# Altium project PROC101D_SCH_With_Design_Updates..Notes_V1.0.PrjPcb (part 12 of 23)

## Sheet 27.SchDoc
size 513 x 386 mm
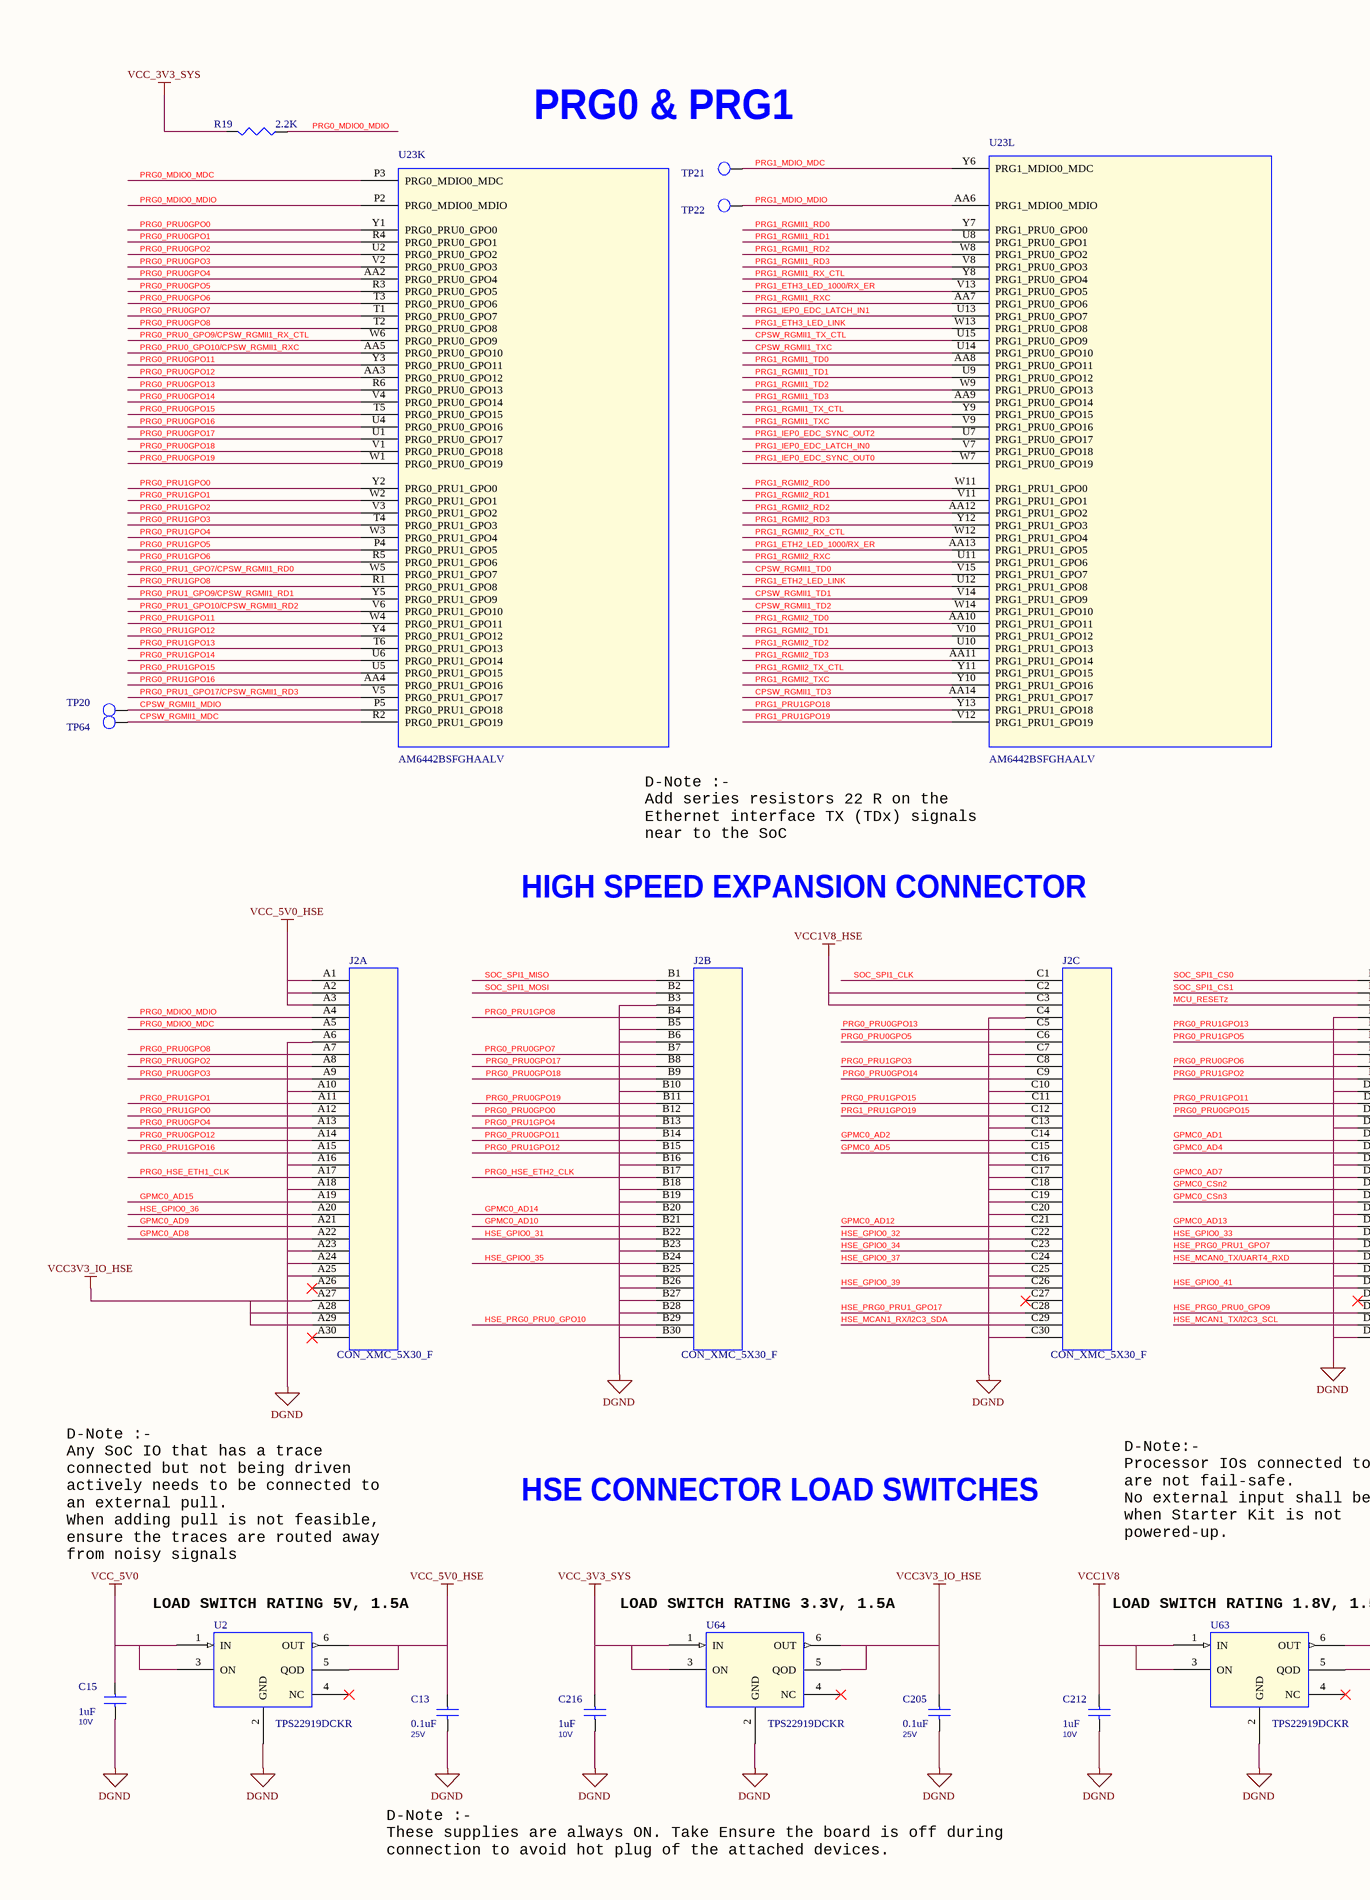
[diagram p46: 27.SchDoc, left]
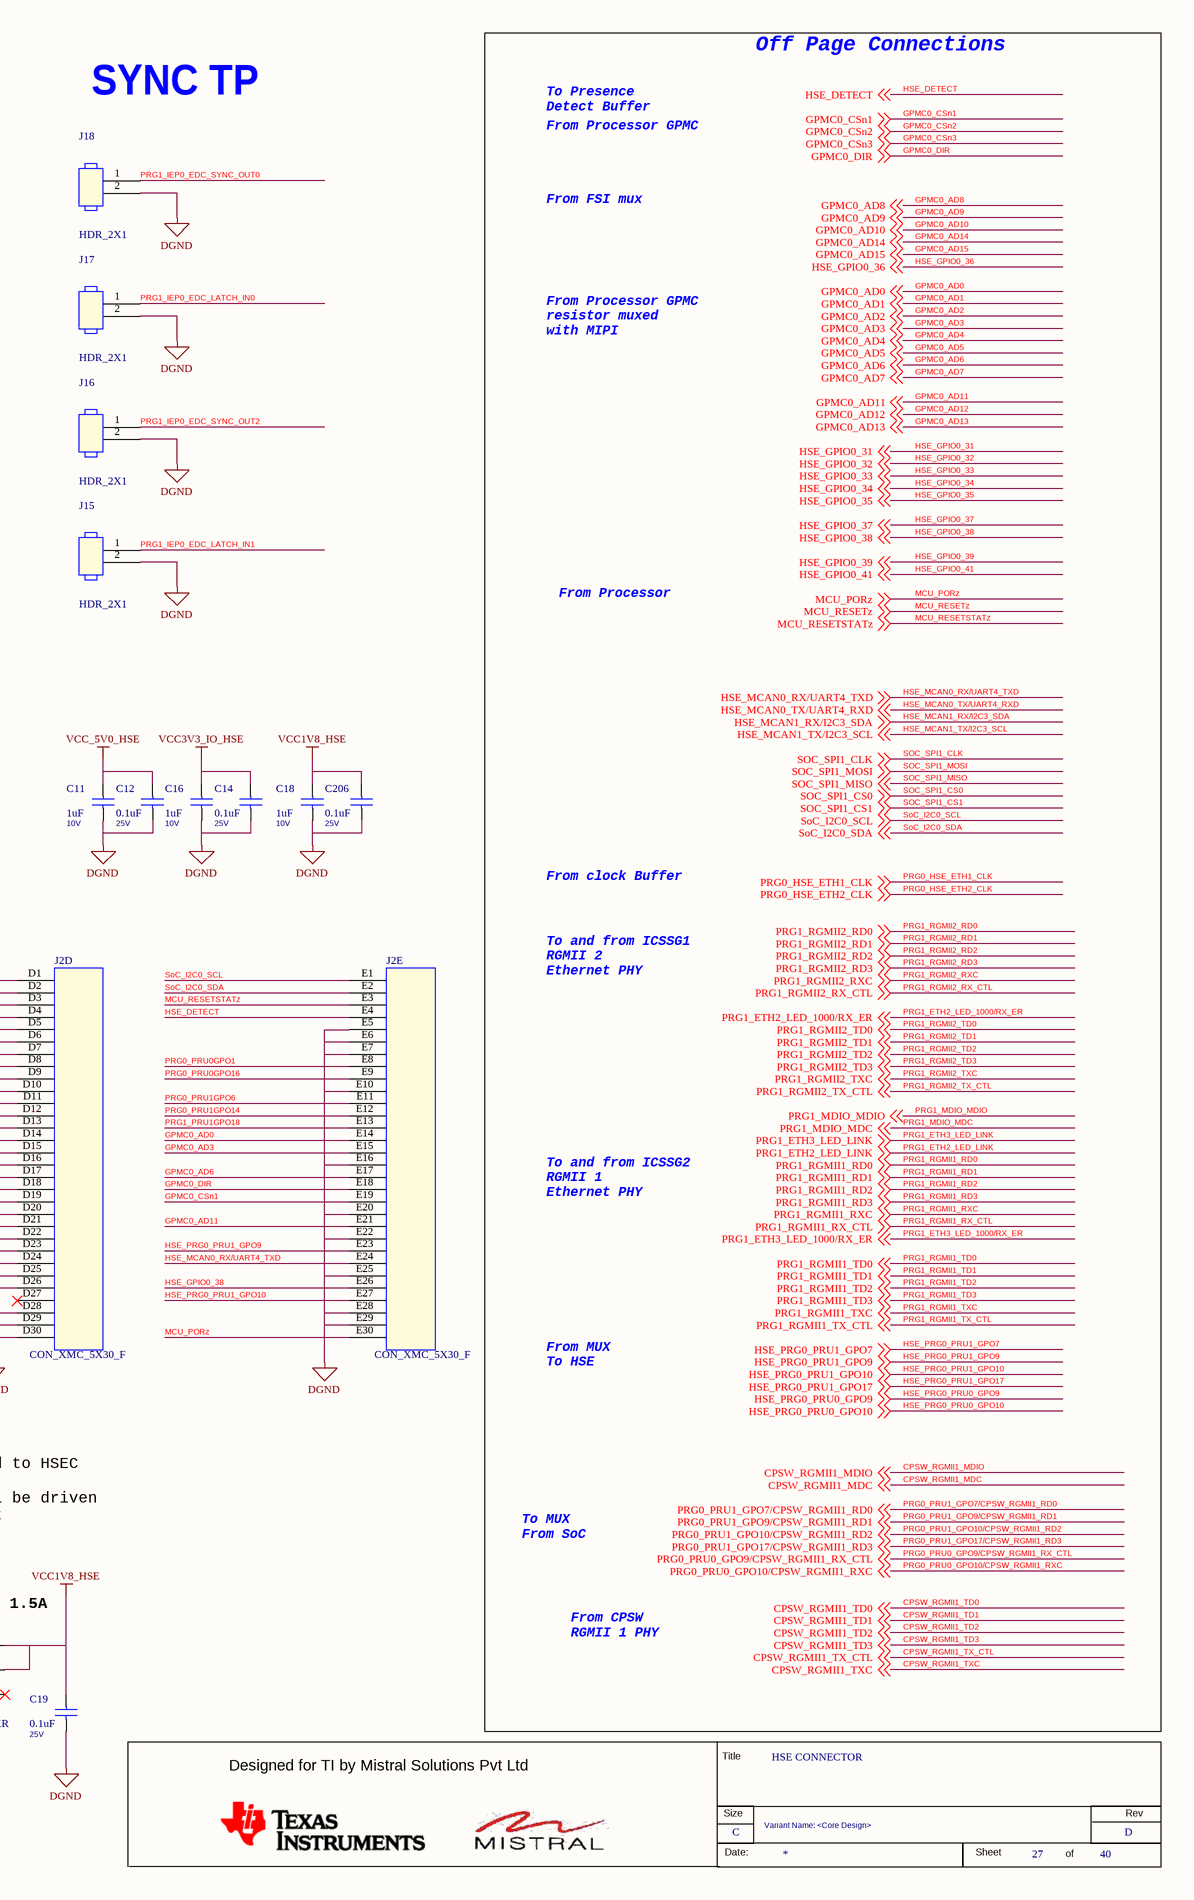
[diagram p47: 27.SchDoc, right]

### Parts
(Parts that share a designator on the sheet are numbered #1, #2 ... from top to bottom, then left to right.)
*#27  RevCode: D  Title: HSE CONNECTOR  Page Size: C  Page Number: 27  Page Count: 40  Variant Name: <Core Design>  (hidden comment: MISTRAL_TITLEBLK_CSIZE)  (graphical)
C11  1uF  Voltage: 10V  [CAP0402_0-75]
C12  0.1uF  Voltage: 25V  [CAP0402_0-75]
C13  0.1uF  Voltage: 25V  [CAP0402_0-75]
C14  0.1uF  Voltage: 25V  [CAP0402_0-75]
C15  1uF  Voltage: 10V  [CAP0402_0-75]
C16  1uF  Voltage: 10V  [CAP0402_0-75]
C18  1uF  Voltage: 10V  [CAP0402_0-75]
C19  0.1uF  Voltage: 25V  [CAP0402_0-75]
C205  0.1uF  Voltage: 25V  [CAP0402_0-75]
C206  0.1uF  Voltage: 25V  [CAP0402_0-75]
C212  1uF  Voltage: 10V  [CAP0402_0-75]
C216  1uF  Voltage: 10V  [CAP0402_0-75]
J2  CON_XMC_5X30_F  [CON_XMC5X30_SEAF-30-06-05-2-A_S_S_S_6-4]  (parts A,B,C,D,E of 5)
J15  HDR_2X1  [HDR_2X1_100_S_T]
J16  HDR_2X1  [HDR_2X1_100_S_T]
J17  HDR_2X1  [HDR_2X1_100_S_T]
J18  HDR_2X1  [HDR_2X1_100_S_T]
R19  2.2K  [RES0402_0-5]
TP20  TP20_SMD  [TP20_SMD]  (value not drawn)
TP21  TP20_SMD  [TP20_SMD]  (value not drawn)
TP22  TP20_SMD  [TP20_SMD]  (value not drawn)
TP64  TP20_SMD  [TP20_SMD]  (value not drawn)
U2  TPS22919DCKR  [SC70-6_1-1]
U23  AM6442BSFGHAALV  [FCBGA441_31-49_680X680_2-6]  (parts K,L of 16)
U63  TPS22919DCKR  [SC70-6_1-1]
U64  TPS22919DCKR  [SC70-6_1-1]

### Nets
DGND: C11.2 C12.2 C13.2 C14.2 C15.2 C16.2 C18.2 C19.2 C205.2 C206.2 C212.2 C216.2 J2.A6 J2.A10 J2.A16 J2.A18 J2.A23 J2.A24 J2.A25 J2.B3 J2.B5 J2.B6 J2.B10 J2.B16 J2.B18 J2.B19 J2.B23 J2.B25 J2.B26 J2.B27 J2.B28 J2.B30 J2.C4 J2.C7 J2.C10 J2.C13 J2.C16 J2.C17 J2.C18 J2.C19 J2.C20 J2.C25 J2.C30 J2.D4 J2.D7 J2.D10 J2.D13 J2.D16 J2.D20 J2.D25 J2.D30 J2.E5 J2.E6 J2.E7 J2.E10 J2.E16 J2.E20 J2.E22 J2.E25 J2.E28 J2.E29 J15.2 J16.2 J17.2 J18.2 U2.2(GND) U63.2(GND) U64.2(GND)
VCC1V8: C212.1 U63.1(IN) U63.3(ON)
VCC1V8_HSE: C18.1 C19.1 C206.1 J2.C2 J2.C3 U63.5(QOD) U63.6(OUT)
VCC3V3_IO_HSE: C14.1 C16.1 C205.1 J2.A27 J2.A28 J2.A29 U64.5(QOD) U64.6(OUT)
VCC_3V3_SYS: C216.1 R19.2 U64.1(IN) U64.3(ON)
VCC_5V0: C15.1 U2.1(IN) U2.3(ON)
VCC_5V0_HSE: C11.1 C12.1 C13.1 J2.A1 J2.A2 J2.A3 U2.5(QOD) U2.6(OUT)
CPSW_RGMII1_MDC: TP64.1(TP) U23.R2(PRG0_PRU1_GPO19) ; off-sheet CPSW_RGMII1_MDC
CPSW_RGMII1_MDIO: TP20.1(TP) U23.P5(PRG0_PRU1_GPO18) ; off-sheet CPSW_RGMII1_MDIO
CPSW_RGMII1_TD0: U23.V15(PRG1_PRU1_GPO7) ; off-sheet CPSW_RGMII1_TD0
CPSW_RGMII1_TD1: U23.V14(PRG1_PRU1_GPO9) ; off-sheet CPSW_RGMII1_TD1
CPSW_RGMII1_TD2: U23.W14(PRG1_PRU1_GPO10) ; off-sheet CPSW_RGMII1_TD2
CPSW_RGMII1_TD3: U23.AA14(PRG1_PRU1_GPO17) ; off-sheet CPSW_RGMII1_TD3
CPSW_RGMII1_TX_CTL: U23.U15(PRG1_PRU0_GPO9) ; off-sheet CPSW_RGMII1_TX_CTL
CPSW_RGMII1_TXC: U23.U14(PRG1_PRU0_GPO10) ; off-sheet CPSW_RGMII1_TXC
GPMC0_AD0: J2.E14 ; off-sheet GPMC0_AD0
GPMC0_AD1: J2.D14 ; off-sheet GPMC0_AD1
GPMC0_AD2: J2.C14 ; off-sheet GPMC0_AD2
GPMC0_AD3: J2.E15 ; off-sheet GPMC0_AD3
GPMC0_AD4: J2.D15 ; off-sheet GPMC0_AD4
GPMC0_AD5: J2.C15 ; off-sheet GPMC0_AD5
GPMC0_AD6: J2.E17 ; off-sheet GPMC0_AD6
GPMC0_AD7: J2.D17 ; off-sheet GPMC0_AD7
GPMC0_AD8: J2.A22 ; off-sheet GPMC0_AD8
GPMC0_AD9: J2.A21 ; off-sheet GPMC0_AD9
GPMC0_AD10: J2.B21 ; off-sheet GPMC0_AD10
GPMC0_AD11: J2.E21 ; off-sheet GPMC0_AD11
GPMC0_AD12: J2.C21 ; off-sheet GPMC0_AD12
GPMC0_AD13: J2.D21 ; off-sheet GPMC0_AD13
GPMC0_AD14: J2.B20 ; off-sheet GPMC0_AD14
GPMC0_AD15: J2.A19 ; off-sheet GPMC0_AD15
GPMC0_CSn1: J2.E19 ; off-sheet GPMC0_CSn1
GPMC0_CSn2: J2.D18 ; off-sheet GPMC0_CSn2
GPMC0_CSn3: J2.D19 ; off-sheet GPMC0_CSn3
GPMC0_DIR: J2.E18 ; off-sheet GPMC0_DIR
HSE_DETECT: J2.E4 ; off-sheet HSE_DETECT
HSE_GPIO0_31: J2.B22 ; off-sheet HSE_GPIO0_31
HSE_GPIO0_32: J2.C22 ; off-sheet HSE_GPIO0_32
HSE_GPIO0_33: J2.D22 ; off-sheet HSE_GPIO0_33
HSE_GPIO0_34: J2.C23 ; off-sheet HSE_GPIO0_34
HSE_GPIO0_35: J2.B24 ; off-sheet HSE_GPIO0_35
HSE_GPIO0_36: J2.A20 ; off-sheet HSE_GPIO0_36
HSE_GPIO0_37: J2.C24 ; off-sheet HSE_GPIO0_37
HSE_GPIO0_38: J2.E26 ; off-sheet HSE_GPIO0_38
HSE_GPIO0_39: J2.C26 ; off-sheet HSE_GPIO0_39
HSE_GPIO0_41: J2.D26 ; off-sheet HSE_GPIO0_41
HSE_MCAN0_RX/UART4_TXD: J2.E24 ; off-sheet HSE_MCAN0_RX/UART4_TXD
HSE_MCAN0_TX/UART4_RXD: J2.D24 ; off-sheet HSE_MCAN0_TX/UART4_RXD
HSE_MCAN1_RX/I2C3_SDA: J2.C29 ; off-sheet HSE_MCAN1_RX/I2C3_SDA
HSE_MCAN1_TX/I2C3_SCL: J2.D29 ; off-sheet HSE_MCAN1_TX/I2C3_SCL
HSE_PRG0_PRU0_GPO9: J2.D28 ; off-sheet HSE_PRG0_PRU0_GPO9
HSE_PRG0_PRU0_GPO10: J2.B29 ; off-sheet HSE_PRG0_PRU0_GPO10
HSE_PRG0_PRU1_GPO7: J2.D23 ; off-sheet HSE_PRG0_PRU1_GPO7
HSE_PRG0_PRU1_GPO9: J2.E23 ; off-sheet HSE_PRG0_PRU1_GPO9
HSE_PRG0_PRU1_GPO10: J2.E27 ; off-sheet HSE_PRG0_PRU1_GPO10
HSE_PRG0_PRU1_GPO17: J2.C28 ; off-sheet HSE_PRG0_PRU1_GPO17
MCU_PORz: J2.E30 ; off-sheet MCU_PORz
MCU_RESETSTATz: J2.E3 ; off-sheet MCU_RESETSTATz
MCU_RESETz: J2.D3 ; off-sheet MCU_RESETz
PRG0_HSE_ETH1_CLK: J2.A17 ; off-sheet PRG0_HSE_ETH1_CLK
PRG0_HSE_ETH2_CLK: J2.B17 ; off-sheet PRG0_HSE_ETH2_CLK
PRG0_MDIO0_MDC: J2.A5 U23.P3(PRG0_MDIO0_MDC)
PRG0_MDIO0_MDIO: J2.A4 R19.1 U23.P2(PRG0_MDIO0_MDIO)
PRG0_PRU0_GPO9/CPSW_RGMII1_RX_CTL: U23.W6(PRG0_PRU0_GPO9) ; off-sheet PRG0_PRU0_GPO9/CPSW_RGMII1_RX_CTL
PRG0_PRU0_GPO10/CPSW_RGMII1_RXC: U23.AA5(PRG0_PRU0_GPO10) ; off-sheet PRG0_PRU0_GPO10/CPSW_RGMII1_RXC
PRG0_PRU0GPO0: J2.B12 U23.Y1(PRG0_PRU0_GPO0)
PRG0_PRU0GPO1: J2.E8 U23.R4(PRG0_PRU0_GPO1)
PRG0_PRU0GPO2: J2.A8 U23.U2(PRG0_PRU0_GPO2)
PRG0_PRU0GPO3: J2.A9 U23.V2(PRG0_PRU0_GPO3)
PRG0_PRU0GPO4: J2.A13 U23.AA2(PRG0_PRU0_GPO4)
PRG0_PRU0GPO5: J2.C6 U23.R3(PRG0_PRU0_GPO5)
PRG0_PRU0GPO6: J2.D8 U23.T3(PRG0_PRU0_GPO6)
PRG0_PRU0GPO7: J2.B7 U23.T1(PRG0_PRU0_GPO7)
PRG0_PRU0GPO8: J2.A7 U23.T2(PRG0_PRU0_GPO8)
PRG0_PRU0GPO11: J2.B14 U23.Y3(PRG0_PRU0_GPO11)
PRG0_PRU0GPO12: J2.A14 U23.AA3(PRG0_PRU0_GPO12)
PRG0_PRU0GPO13: J2.C5 U23.R6(PRG0_PRU0_GPO13)
PRG0_PRU0GPO14: J2.C9 U23.V4(PRG0_PRU0_GPO14)
PRG0_PRU0GPO15: J2.D12 U23.T5(PRG0_PRU0_GPO15)
PRG0_PRU0GPO16: J2.E9 U23.U4(PRG0_PRU0_GPO16)
PRG0_PRU0GPO17: J2.B8 U23.U1(PRG0_PRU0_GPO17)
PRG0_PRU0GPO18: J2.B9 U23.V1(PRG0_PRU0_GPO18)
PRG0_PRU0GPO19: J2.B11 U23.W1(PRG0_PRU0_GPO19)
PRG0_PRU1_GPO7/CPSW_RGMII1_RD0: U23.W5(PRG0_PRU1_GPO7) ; off-sheet PRG0_PRU1_GPO7/CPSW_RGMII1_RD0
PRG0_PRU1_GPO9/CPSW_RGMII1_RD1: U23.Y5(PRG0_PRU1_GPO9) ; off-sheet PRG0_PRU1_GPO9/CPSW_RGMII1_RD1
PRG0_PRU1_GPO10/CPSW_RGMII1_RD2: U23.V6(PRG0_PRU1_GPO10) ; off-sheet PRG0_PRU1_GPO10/CPSW_RGMII1_RD2
PRG0_PRU1_GPO17/CPSW_RGMII1_RD3: U23.V5(PRG0_PRU1_GPO17) ; off-sheet PRG0_PRU1_GPO17/CPSW_RGMII1_RD3
PRG0_PRU1GPO0: J2.A12 U23.Y2(PRG0_PRU1_GPO0)
PRG0_PRU1GPO1: J2.A11 U23.W2(PRG0_PRU1_GPO1)
PRG0_PRU1GPO2: J2.D9 U23.V3(PRG0_PRU1_GPO2)
PRG0_PRU1GPO3: J2.C8 U23.T4(PRG0_PRU1_GPO3)
PRG0_PRU1GPO4: J2.B13 U23.W3(PRG0_PRU1_GPO4)
PRG0_PRU1GPO5: J2.D6 U23.P4(PRG0_PRU1_GPO5)
PRG0_PRU1GPO6: J2.E11 U23.R5(PRG0_PRU1_GPO6)
PRG0_PRU1GPO8: J2.B4 U23.R1(PRG0_PRU1_GPO8)
PRG0_PRU1GPO11: J2.D11 U23.W4(PRG0_PRU1_GPO11)
PRG0_PRU1GPO12: J2.B15 U23.Y4(PRG0_PRU1_GPO12)
PRG0_PRU1GPO13: J2.D5 U23.T6(PRG0_PRU1_GPO13)
PRG0_PRU1GPO14: J2.E12 U23.U6(PRG0_PRU1_GPO14)
PRG0_PRU1GPO15: J2.C11 U23.U5(PRG0_PRU1_GPO15)
PRG0_PRU1GPO16: J2.A15 U23.AA4(PRG0_PRU1_GPO16)
PRG1_ETH2_LED_1000/RX_ER: U23.AA13(PRG1_PRU1_GPO5) ; off-sheet PRG1_ETH2_LED_1000/RX_ER
PRG1_ETH2_LED_LINK: U23.U12(PRG1_PRU1_GPO8) ; off-sheet PRG1_ETH2_LED_LINK
PRG1_ETH3_LED_1000/RX_ER: U23.V13(PRG1_PRU0_GPO5) ; off-sheet PRG1_ETH3_LED_1000/RX_ER
PRG1_ETH3_LED_LINK: U23.W13(PRG1_PRU0_GPO8) ; off-sheet PRG1_ETH3_LED_LINK
PRG1_IEP0_EDC_LATCH_IN0: J17.1 U23.V7(PRG1_PRU0_GPO18)
PRG1_IEP0_EDC_LATCH_IN1: J15.1 U23.U13(PRG1_PRU0_GPO7)
PRG1_IEP0_EDC_SYNC_OUT0: J18.1 U23.W7(PRG1_PRU0_GPO19)
PRG1_IEP0_EDC_SYNC_OUT2: J16.1 U23.U7(PRG1_PRU0_GPO17)
PRG1_MDIO_MDC: TP21.1(TP) U23.Y6(PRG1_MDIO0_MDC) ; off-sheet PRG1_MDIO_MDC
PRG1_MDIO_MDIO: TP22.1(TP) U23.AA6(PRG1_MDIO0_MDIO) ; off-sheet PRG1_MDIO_MDIO
PRG1_PRU1GPO18: J2.E13 U23.Y13(PRG1_PRU1_GPO18)
PRG1_PRU1GPO19: J2.C12 U23.V12(PRG1_PRU1_GPO19)
PRG1_RGMII1_RD0: U23.Y7(PRG1_PRU0_GPO0) ; off-sheet PRG1_RGMII1_RD0
PRG1_RGMII1_RD1: U23.U8(PRG1_PRU0_GPO1) ; off-sheet PRG1_RGMII1_RD1
PRG1_RGMII1_RD2: U23.W8(PRG1_PRU0_GPO2) ; off-sheet PRG1_RGMII1_RD2
PRG1_RGMII1_RD3: U23.V8(PRG1_PRU0_GPO3) ; off-sheet PRG1_RGMII1_RD3
PRG1_RGMII1_RX_CTL: U23.Y8(PRG1_PRU0_GPO4) ; off-sheet PRG1_RGMII1_RX_CTL
PRG1_RGMII1_RXC: U23.AA7(PRG1_PRU0_GPO6) ; off-sheet PRG1_RGMII1_RXC
PRG1_RGMII1_TD0: U23.AA8(PRG1_PRU0_GPO11) ; off-sheet PRG1_RGMII1_TD0
PRG1_RGMII1_TD1: U23.U9(PRG1_PRU0_GPO12) ; off-sheet PRG1_RGMII1_TD1
PRG1_RGMII1_TD2: U23.W9(PRG1_PRU0_GPO13) ; off-sheet PRG1_RGMII1_TD2
PRG1_RGMII1_TD3: U23.AA9(PRG1_PRU0_GPO14) ; off-sheet PRG1_RGMII1_TD3
PRG1_RGMII1_TX_CTL: U23.Y9(PRG1_PRU0_GPO15) ; off-sheet PRG1_RGMII1_TX_CTL
PRG1_RGMII1_TXC: U23.V9(PRG1_PRU0_GPO16) ; off-sheet PRG1_RGMII1_TXC
PRG1_RGMII2_RD0: U23.W11(PRG1_PRU1_GPO0) ; off-sheet PRG1_RGMII2_RD0
PRG1_RGMII2_RD1: U23.V11(PRG1_PRU1_GPO1) ; off-sheet PRG1_RGMII2_RD1
PRG1_RGMII2_RD2: U23.AA12(PRG1_PRU1_GPO2) ; off-sheet PRG1_RGMII2_RD2
PRG1_RGMII2_RD3: U23.Y12(PRG1_PRU1_GPO3) ; off-sheet PRG1_RGMII2_RD3
PRG1_RGMII2_RX_CTL: U23.W12(PRG1_PRU1_GPO4) ; off-sheet PRG1_RGMII2_RX_CTL
PRG1_RGMII2_RXC: U23.U11(PRG1_PRU1_GPO6) ; off-sheet PRG1_RGMII2_RXC
PRG1_RGMII2_TD0: U23.AA10(PRG1_PRU1_GPO11) ; off-sheet PRG1_RGMII2_TD0
PRG1_RGMII2_TD1: U23.V10(PRG1_PRU1_GPO12) ; off-sheet PRG1_RGMII2_TD1
PRG1_RGMII2_TD2: U23.U10(PRG1_PRU1_GPO13) ; off-sheet PRG1_RGMII2_TD2
PRG1_RGMII2_TD3: U23.AA11(PRG1_PRU1_GPO14) ; off-sheet PRG1_RGMII2_TD3
PRG1_RGMII2_TX_CTL: U23.Y11(PRG1_PRU1_GPO15) ; off-sheet PRG1_RGMII2_TX_CTL
PRG1_RGMII2_TXC: U23.Y10(PRG1_PRU1_GPO16) ; off-sheet PRG1_RGMII2_TXC
SoC_I2C0_SCL: J2.E1 ; off-sheet SoC_I2C0_SCL
SoC_I2C0_SDA: J2.E2 ; off-sheet SoC_I2C0_SDA
SOC_SPI1_CLK: J2.C1 ; off-sheet SOC_SPI1_CLK
SOC_SPI1_CS0: J2.D1 ; off-sheet SOC_SPI1_CS0
SOC_SPI1_CS1: J2.D2 ; off-sheet SOC_SPI1_CS1
SOC_SPI1_MISO: J2.B1 ; off-sheet SOC_SPI1_MISO
SOC_SPI1_MOSI: J2.B2 ; off-sheet SOC_SPI1_MOSI

Not connected (* = marked no-connect by the designer): J2 A26* A30* C27* D27*; U2 4(NC)*; U63 4(NC)*; U64 4(NC)*

### Notes on the sheet
- Off Page Connections
- SYNC TP
- To Presence
  Detect Buffer
- (near TP21) PRG0 & PRG1
- From Processor GPMC
- From FSI mux
- From Processor GPMC
  resistor muxed
  with MIPI
- From Processor
- D-Note :-
  Add series resistors 22 R on the
  Ethernet interface TX (TDx) signals
  near to the SoC
- HIGH SPEED EXPANSION CONNECTOR
- From clock Buffer
- To and from ICSSG1
  RGMII 2
  Ethernet PHY
- To and from ICSSG2
  RGMII 1
  Ethernet PHY
- From MUX
  To HSE
- D-Note :-
  Any SoC IO that has a trace
  connected but not being driven
  actively needs to be connected to
  an external pull.
  When adding pull is not feasible,
  ensure the traces are routed away
  from noisy signals
- D-Note:-
  Processor IOs connected to HSEC
  are not fail-safe.
  No external input shall be driven
  when Starter Kit is not
  powered-up.
- HSE CONNECTOR LOAD SWITCHES
- To MUX
  From SoC
- (near U2) LOAD SWITCH RATING 5V, 1.5A
- (near U64) LOAD SWITCH RATING 3.3V, 1.5A
- (near U63) LOAD SWITCH RATING 1.8V, 1.5A
- From CPSW
  RGMII 1 PHY
- D-Note :-
  These supplies are always ON. Take Ensure the board is off during
  connection to avoid hot plug of the attached devices.
- (in symbol MISTRAL_TITLEBLK_CSIZE) Title; Designed for TI by Mistral Solutions Pvt Ltd; Size; Rev; Date:; Sheet; of

### Library data of the parts
*#27 = MISTRAL_TITLEBLK_CSIZE: Issue: 1.0; Page Create Date: March  8, 1995; Page Modify Date: *
C11 C18 = CAP_Dup3: CAP CERAMIC 1uF 10V 20% X5R 0402; Mistral Part No: 120020080009-R; Mfr_name: WURTH ELECTRONICS; Mfr_part_number: 885012105012; Part_type: CAPACITORS\CERAMIC; Wattage: NA; Project: AM64x_EVM_BRD; Customs_HS_Code: 85322990; Custom_Duty: 15%; Footprint Ref: CAP0402_0-75; Library Ref: CAP; Footprint Path: Y:\MIS_DATABASE\Library\ALTIUM_TOOL\PCB_FOOTPRINTS\Altium_Footprint_Lib.PcbLib; Library Path: Y:\MIS_DATABASE\Library\ALTIUM_TOOL\SCHEMATICS_PARTS\MS_DISCRETE_Library.schlib; MECHANICAL 3D STEP FILE: CAP0402_0-75; Tolerance: 20%; Package: 0402; Distributor_name: DIGIKEY; Distributor_part_number: 732-7489-1-ND; Height: 0.55MM; Weight: 0.65mg; Temperature: -55癈+85癈; Datasheet: Y:\MIS_DATABASE\DATASHEETS\CAPACITORS\885012105012.PDF; Crtd /date: ALVY/190820; Chkd/date: MANIRAJA/210820; PCB Footprint: CAP0402_0-75
C12-C14 C206 = CAP_Dup3: CAP CERAMIC 0.1uF 25V 20% X5R 0402; Alt_Mfr_name: YAGEO AMERICA; Part_type: CAPACITORS\CERAMIC; Mfr_part_number: 885012105018; Mfr_name: WURTH ELECTRONICS; Mistral Part No: 120020080003-R; Alt_Mfr_part_number: CC0402KRX5R8BB104; Custom_Duty: 15%; Customs_HS_Code: 85322990; Wattage: NA; Project: AM64x_EVM_BRD; Footprint Path: Y:\MIS_DATABASE\Library\ALTIUM_TOOL\PCB_FOOTPRINTS\Altium_Footprint_Lib.PcbLib; Library Path: Y:\MIS_DATABASE\Library\ALTIUM_TOOL\SCHEMATICS_PARTS\MS_DISCRETE_Library.schlib; Footprint Ref: CAP0402_0-75; Library Ref: CAP; MECHANICAL 3D STEP FILE: CAP0402_0-75; Chkd/date: MANIRAJA/170820; Crtd /date: ALVY/170820; Datasheet: Y:\MIS_DATABASE\DATASHEETS\CAPACITORS\885012105018.PDF; Temperature: -55癈+85癈; Weight: 0.65mg; Height: 0.55MM; Distributor_part_number: 732-7495-1-ND; Distributor_name: DIGIKEY; Package: 0402; Tolerance: 20%; PCB Footprint: CAP0402_0-75
C15 C216 = CAP_Dup3: CAP CERAMIC 1uF 10V 20% X5R 0402; Mistral Part No: 120020080009-R; Mfr_name: WURTH ELECTRONICS; Mfr_part_number: 885012105012; Part_type: CAPACITORS\CERAMIC; Project: AM64x_EVM_BRD; Wattage: NA; Customs_HS_Code: 85322990; Custom_Duty: 15%; PCB Footprint: CAP0402_0-75; Footprint Path: Y:\MIS_DATABASE\Library\ALTIUM_TOOL\PCB_FOOTPRINTS\Altium_Footprint_Lib.PcbLib; Library Path: Y:\MIS_DATABASE\Library\ALTIUM_TOOL\SCHEMATICS_PARTS\MS_DISCRETE_Library.schlib; Footprint Ref: CAP0402_0-75; Library Ref: CAP; MECHANICAL 3D STEP FILE: CAP0402_0-75; Tolerance: 20%; Package: 0402; Distributor_name: DIGIKEY; Distributor_part_number: 732-7489-1-ND; Height: 0.55MM; Weight: 0.65mg; Temperature: -55癈+85癈; Datasheet: Y:\MIS_DATABASE\DATASHEETS\CAPACITORS\885012105012.PDF; Crtd /date: ALVY/190820; Chkd/date: MANIRAJA/210820
C16 = CAP_Dup3: CAP CERAMIC 1uF 10V 20% X5R 0402; Part_type: CAPACITORS\CERAMIC; Mfr_part_number: 885012105012; Mfr_name: WURTH ELECTRONICS; Mistral Part No: 120020080009-R; Wattage: NA; Custom_Duty: 15%; Customs_HS_Code: 85322990; Project: AM64x_EVM_BRD; Footprint Ref: CAP0402_0-75; Library Ref: CAP; Footprint Path: Y:\MIS_DATABASE\Library\ALTIUM_TOOL\PCB_FOOTPRINTS\Altium_Footprint_Lib.PcbLib; Library Path: Y:\MIS_DATABASE\Library\ALTIUM_TOOL\SCHEMATICS_PARTS\MS_DISCRETE_Library.schlib; MECHANICAL 3D STEP FILE: CAP0402_0-75; Chkd/date: MANIRAJA/210820; Crtd /date: ALVY/190820; Datasheet: Y:\MIS_DATABASE\DATASHEETS\CAPACITORS\885012105012.PDF; Temperature: -55癈+85癈; Weight: 0.65mg; Height: 0.55MM; Distributor_part_number: 732-7489-1-ND; Distributor_name: DIGIKEY; Package: 0402; Tolerance: 20%; PCB Footprint: CAP0402_0-75
C19 C205 = CAP_Dup3: CAP CERAMIC 0.1uF 25V 20% X5R 0402; Alt_Mfr_part_number: CC0402KRX5R8BB104; Mistral Part No: 120020080003-R; Mfr_name: WURTH ELECTRONICS; Mfr_part_number: 885012105018; Part_type: CAPACITORS\CERAMIC; Alt_Mfr_name: YAGEO AMERICA; Project: AM64x_EVM_BRD; Wattage: NA; Customs_HS_Code: 85322990; Custom_Duty: 15%; PCB Footprint: CAP0402_0-75; Tolerance: 20%; Package: 0402; Distributor_name: DIGIKEY; Distributor_part_number: 732-7495-1-ND; Height: 0.55MM; Weight: 0.65mg; Temperature: -55癈+85癈; Datasheet: Y:\MIS_DATABASE\DATASHEETS\CAPACITORS\885012105018.PDF; Crtd /date: ALVY/170820; Chkd/date: MANIRAJA/170820; MECHANICAL 3D STEP FILE: CAP0402_0-75; Library Ref: CAP; Footprint Ref: CAP0402_0-75; Library Path: Y:\MIS_DATABASE\Library\ALTIUM_TOOL\SCHEMATICS_PARTS\MS_DISCRETE_Library.schlib; Footprint Path: Y:\MIS_DATABASE\Library\ALTIUM_TOOL\PCB_FOOTPRINTS\Altium_Footprint_Lib.PcbLib
C212 = CAP_Dup3: CAP CERAMIC 1uF 10V 20% X5R 0402; Part_type: CAPACITORS\CERAMIC; Mfr_part_number: 885012105012; Mfr_name: WURTH ELECTRONICS; Mistral Part No: 120020080009-R; Custom_Duty: 15%; Customs_HS_Code: 85322990; Wattage: NA; Project: AM64x_EVM_BRD; PCB Footprint: CAP0402_0-75; Chkd/date: MANIRAJA/210820; Crtd /date: ALVY/190820; Datasheet: Y:\MIS_DATABASE\DATASHEETS\CAPACITORS\885012105012.PDF; Temperature: -55癈+85癈; Weight: 0.65mg; Height: 0.55MM; Distributor_part_number: 732-7489-1-ND; Distributor_name: DIGIKEY; Package: 0402; Tolerance: 20%; MECHANICAL 3D STEP FILE: CAP0402_0-75; Library Ref: CAP; Footprint Ref: CAP0402_0-75; Library Path: Y:\MIS_DATABASE\Library\ALTIUM_TOOL\SCHEMATICS_PARTS\MS_DISCRETE_Library.schlib; Footprint Path: Y:\MIS_DATABASE\Library\ALTIUM_TOOL\PCB_FOOTPRINTS\Altium_Footprint_Lib.PcbLib
J2 = CON_XMC30X5_F_SEAF: CON XMC 5X30 1.27MM PITCH FEMALE ST SMD; Mistral Part No: 150020060030-R; Mfr_name: SAMTEC; Mfr_part_number: SEAF-30-06.0-L-05-2-A-K-TR; Part_type: CONNECTOR\XMC; Project: AM64x-GP_EVM BRD; Tolerance: NA; Customs_HS_Code: 85369090; Custom_Duty: 24%; Footprint Ref: CON_XMC5X30_SEAF-30-06-05-2-A_S_S_S_6-4; Voltage: NA; Wattage: NA; Package: SMD; Distributor_name: DIGIKEY; Distributor_part_number: SEAF-30-06.0-L-05-2-A-K-TR-ND; Library Ref: CON_XMC30X5_F_SEAF; Height: 6.34MM; Weight: NA; Temperature: -55癈+125癈; Datasheet: Y:\MIS_DATABASE\DATASHEETS\CONNECTORS\SEAF-A-SER.PDF; Crtd /date: ALVY/190620; Chkd/date: MANIRAJA/190620; MECHANICAL 3D STEP FILE: CON_XMC5X30_SEAF-30-06-05-2-A_S_S_S_6-4; Library Path: Y:\MIS_DATABASE\Library\ALTIUM_TOOL\SCHEMATICS_PARTS\MS_CONNECTOR_Library.schlib; Footprint Path: Y:\MIS_DATABASE\Library\ALTIUM_TOOL\PCB_FOOTPRINTS\Altium_Footprint_Lib.PcbLib; PCB Footprint: CON_XMC5X30_SEAF-30-06-05-2-A_S_S_S_6-4
J15-J18 = HEADER_2X1: CON HDR 2X1 2.54MM PITCH ST TH; Mistral Part No: 150012100005-R; Mfr_name: MOLEX; Mfr_part_number: 90120-0122; Part_type: CONNECTOR\HEADERS; Project: NPOL_FEP; Tolerance: NA; Customs_HS_Code: 85369090; Custom_Duty: 24%; PCB Footprint: HDR_2X1_100_S_T; Voltage: NA; Wattage: NA; Package: THRU-HOLE; Distributor_name: DIGIKEY; Distributor_part_number: WM8072-ND; Library Ref: HEADER_2X1; Height: 5.60MM; Weight: NA; Temperature: -55癈+125癈; Datasheet: Y:\MIS_DATABASE\DATASHEETS\CONNECTORS\90120-SERIES.PDF; Crtd /date: USMAN/031012; Chkd/date: NAVEED/210714
R19 = RESISTOR_Dup6: RES 2.2K 1/16W 5% 0402; Mistral Part No: 110010120018-R; Mfr_name: YAGEO AMERICA; Mfr_part_number: RC0402JR-072K2L; Part_type: RESISTORS\FIXED; Project: TE4; Voltage: NA; Customs_HS_Code: 85332119; Custom_Duty: 15%; Library Path: Y:\MIS_DATABASE\Library\ALTIUM_TOOL\SCHEMATICS_PARTS\MS_DISCRETE_Library.schlib; Footprint Ref: RES0402_0-5; PCB Footprint: RES0402_0-5; Tolerance: 5%; Wattage: 1/16W; Package: 0402; Distributor_name: DIGIKEY; Distributor_part_number: 311-2.2KJRCT-ND; Height: 0.40MM; Weight: 0.65mg; Temperature: -55癈+155癈; Datasheet: Y:\MIS_DATABASE\DATASHEETS\RESISTORS\RCXXXXL-SER_MAR18.PDF; Crtd /date: BAVISH/021210; Chkd/date: VASANTHA/061216; MECHANICAL 3D STEP FILE: RES0402_0-5; Footprint Path: Y:\MIS_DATABASE\Library\ALTIUM_TOOL\PCB_FOOTPRINTS\Altium_Footprint_Lib.PcbLib; Library Ref: RESISTOR
TP20 TP21 TP64 = TESTPOINT: TESTPOINT CIR 20 SMD; Mistral Part No: NA; Mfr_name: LOCAL; Project: BT MODULE_CSRBC04; RoHS: NA; Footprint Ref: TP20_SMD; Library Ref: TESTPOINT; Mfr_part_number: TP20_SMD; Part_type: TESTPOINT; Package: SMD; Distributor_name: NA; Distributor_part_number: NA; Height: NA; Crtd /date: MAZHAR/171006; Chkd/date: SHREESHAIL/171006; Tolerance: NA; Voltage: NA; Wattage: NA; Weight: NA; Temperature: NA; Datasheet: NA; MECHANICAL 3D STEP FILE: NA; Library Path: Y:\MIS_DATABASE\Library\ALTIUM_TOOL\SCHEMATICS_PARTS\MS_DISCRETE_Library.schlib; Footprint Path: Y:\MIS_DATABASE\Library\ALTIUM_TOOL\PCB_FOOTPRINTS\Altium_Footprint_Lib.PcbLib; PCB Footprint: TP20_SMD; Customs_HS_Code: NA; Custom_Duty: NA
TP22 = TESTPOINT: TESTPOINT CIR 20 SMD; Mfr_name: LOCAL; MECHANICAL 3D STEP FILE: NA; Project: BT MODULE_CSRBC04; Footprint Path: Y:\MIS_DATABASE\Library\ALTIUM_TOOL\PCB_FOOTPRINTS\Altium_Footprint_Lib.PcbLib; Library Path: Y:\MIS_DATABASE\Library\ALTIUM_TOOL\SCHEMATICS_PARTS\MS_DISCRETE_Library.schlib; Datasheet: NA; Temperature: NA; Weight: NA; Wattage: NA; Voltage: NA; Tolerance: NA; Chkd/date: SHREESHAIL/171006; Crtd /date: MAZHAR/171006; Height: NA; Distributor_part_number: NA; Distributor_name: NA; Package: SMD; Part_type: TESTPOINT; Mfr_part_number: TP20_SMD; Mistral Part No: NA; Library Ref: TESTPOINT; Footprint Ref: TP20_SMD; RoHS: NA; PCB Footprint: TP20_SMD; Customs_HS_Code: NA; Custom_Duty: NA
U2 U63 = TPS22919_SC70-6: IC 5.5V 1.5A 90mE SELF PROTECTED LOAD SWITCH CONTROLLED RISE TIME SC70-6; Mistral Part No: 142019050003-R; Mfr_name: TEXAS INSTRUMENTS; Part_type: ICS\POWER\CONTROL; Project: AM654x SOM_TEST_JIG; Tolerance: NA; Customs_HS_Code: 85423100; Custom_Duty: 15%; PCB Footprint: SC70-6_1-1; Footprint Ref: SC70-6_1-1; Mfr_part_number: TPS22919DCKR; Voltage: NA; Wattage: NA; Package: SC70-6; Distributor_name: MOUSER; Distributor_part_number: 595-TPS22919DCKR; Library Ref: TPS22919_SC70-6; Height: 1.10MM; Weight: NA; Temperature: -40癈+105癈; Datasheet: Y:\MIS_DATABASE\DATASHEETS\ICS\POWER\TPS22919.PDF; Crtd /date: ALVY/090519; Chkd/date: MANIRAJA/090519; MECHANICAL 3D STEP FILE: SC70-6_1-1; Library Path: Y:\MIS_DATABASE\Library\ALTIUM_TOOL\SCHEMATICS_PARTS\MS_MISCPOWER_Library.schlib; Footprint Path: Y:\MIS_DATABASE\Library\ALTIUM_TOOL\PCB_FOOTPRINTS\Altium_Footprint_Lib.PcbLib
U23 = XAM6442BSFGGAALV_BGA441: IC AM64x SoC MICROPROCESSOR BGA441; Mistral Part No: 141220080002; Mfr_name: TEXAS INSTRUMENTS; Part_type: ICS\DIGITAL\MICROPROCESSOR; Project: AM64x-GP_EVM BRD; Tolerance: NA; Customs_HS_Code: 85423100; Custom_Duty: 15%; PCB Footprint: FCBGA441_31-49_680X680_2-6; Footprint Ref: FCBGA441_31-49_680X680_2-6; Mfr_part_number: AM6442BSFGHAALV; Voltage: NA; Wattage: NA; Package: BGA441; Distributor_name: NA; Distributor_part_number: NA; Library Ref: XAM6442BSFGGAALV_BGA441; Height: 2.57MM; Weight: NA; Temperature: NA; Datasheet: Y:\MIS_DATABASE\DATASHEETS\ICS\DIGITAL\MICROCONTROLLER\AM64-SoC_SVB.PDF; Crtd /date: ALVY/300322; Chkd/date: ALVY/300322; RoHS: NA; MECHANICAL 3D STEP FILE: FCBGA441_31-49_680X680_2-6; Library Path: Y:\MIS_DATABASE\Library\ALTIUM_TOOL\SCHEMATICS_PARTS\MS_MICROPROCESSOR_Library.schlib; Footprint Path: Y:\MIS_DATABASE\Library\ALTIUM_TOOL\PCB_FOOTPRINTS\Altium_Footprint_Lib.PcbLib
U64 = TPS22919_SC70-6: IC 5.5V 1.5A 90mE SELF PROTECTED LOAD SWITCH CONTROLLED RISE TIME SC70-6; Part_type: ICS\POWER\CONTROL; Mfr_name: TEXAS INSTRUMENTS; Mistral Part No: 142019050003-R; Custom_Duty: 15%; Customs_HS_Code: 85423100; Wattage: NA; Project: AM654x SOM_TEST_JIG; PCB Footprint: SC70-6_1-1; Footprint Path: Y:\MIS_DATABASE\Library\ALTIUM_TOOL\PCB_FOOTPRINTS\Altium_Footprint_Lib.PcbLib; Library Path: Y:\MIS_DATABASE\Library\ALTIUM_TOOL\SCHEMATICS_PARTS\MS_MISCPOWER_Library.schlib; MECHANICAL 3D STEP FILE: SC70-6_1-1; Chkd/date: MANIRAJA/090519; Crtd /date: ALVY/090519; Datasheet: Y:\MIS_DATABASE\DATASHEETS\ICS\POWER\TPS22919.PDF; Temperature: -40癈+105癈; Weight: NA; Height: 1.10MM; Library Ref: TPS22919_SC70-6; Distributor_part_number: 595-TPS22919DCKR; Distributor_name: MOUSER; Package: SC70-6; Voltage: NA; Tolerance: NA; Mfr_part_number: TPS22919DCKR; Footprint Ref: SC70-6_1-1

## Sheet 28.SchDoc
size 513 x 386 mm
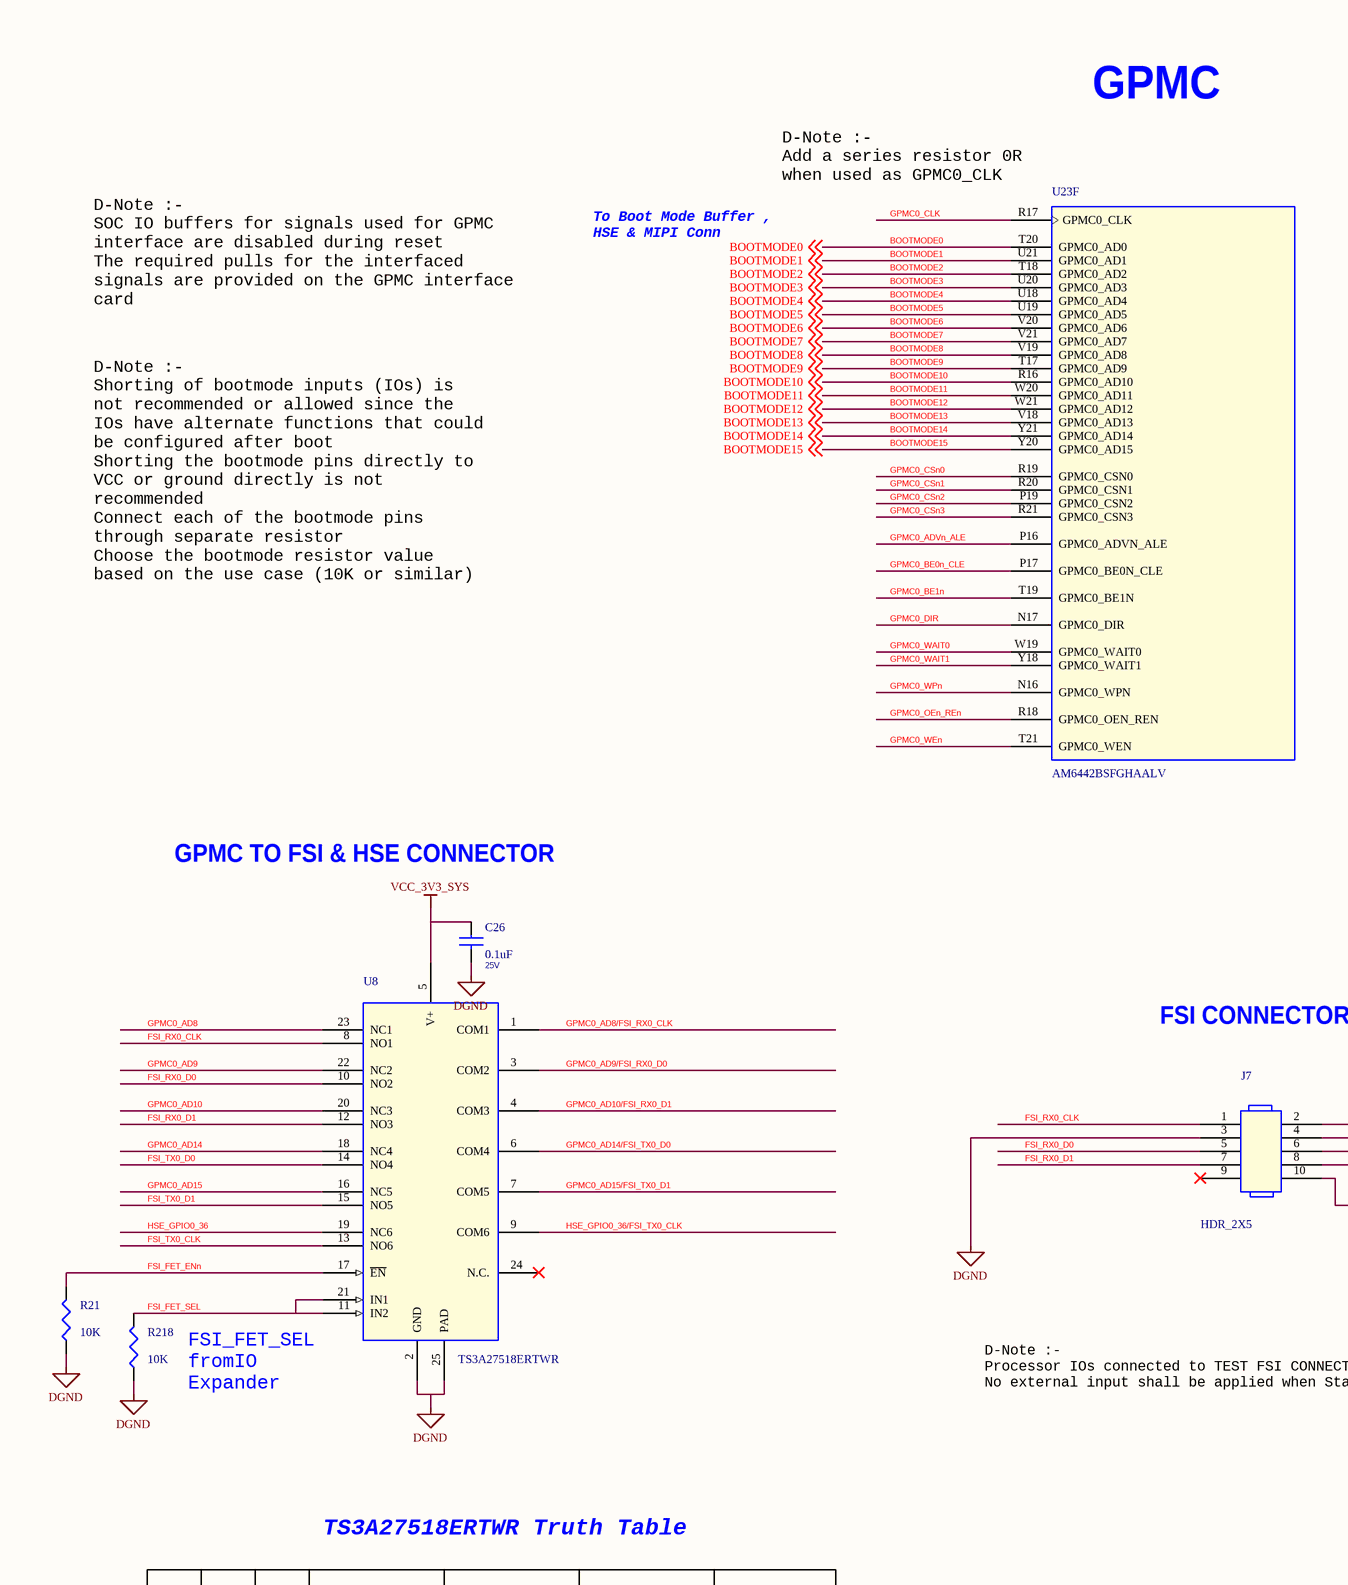
[diagram p48: 28.SchDoc, top left]
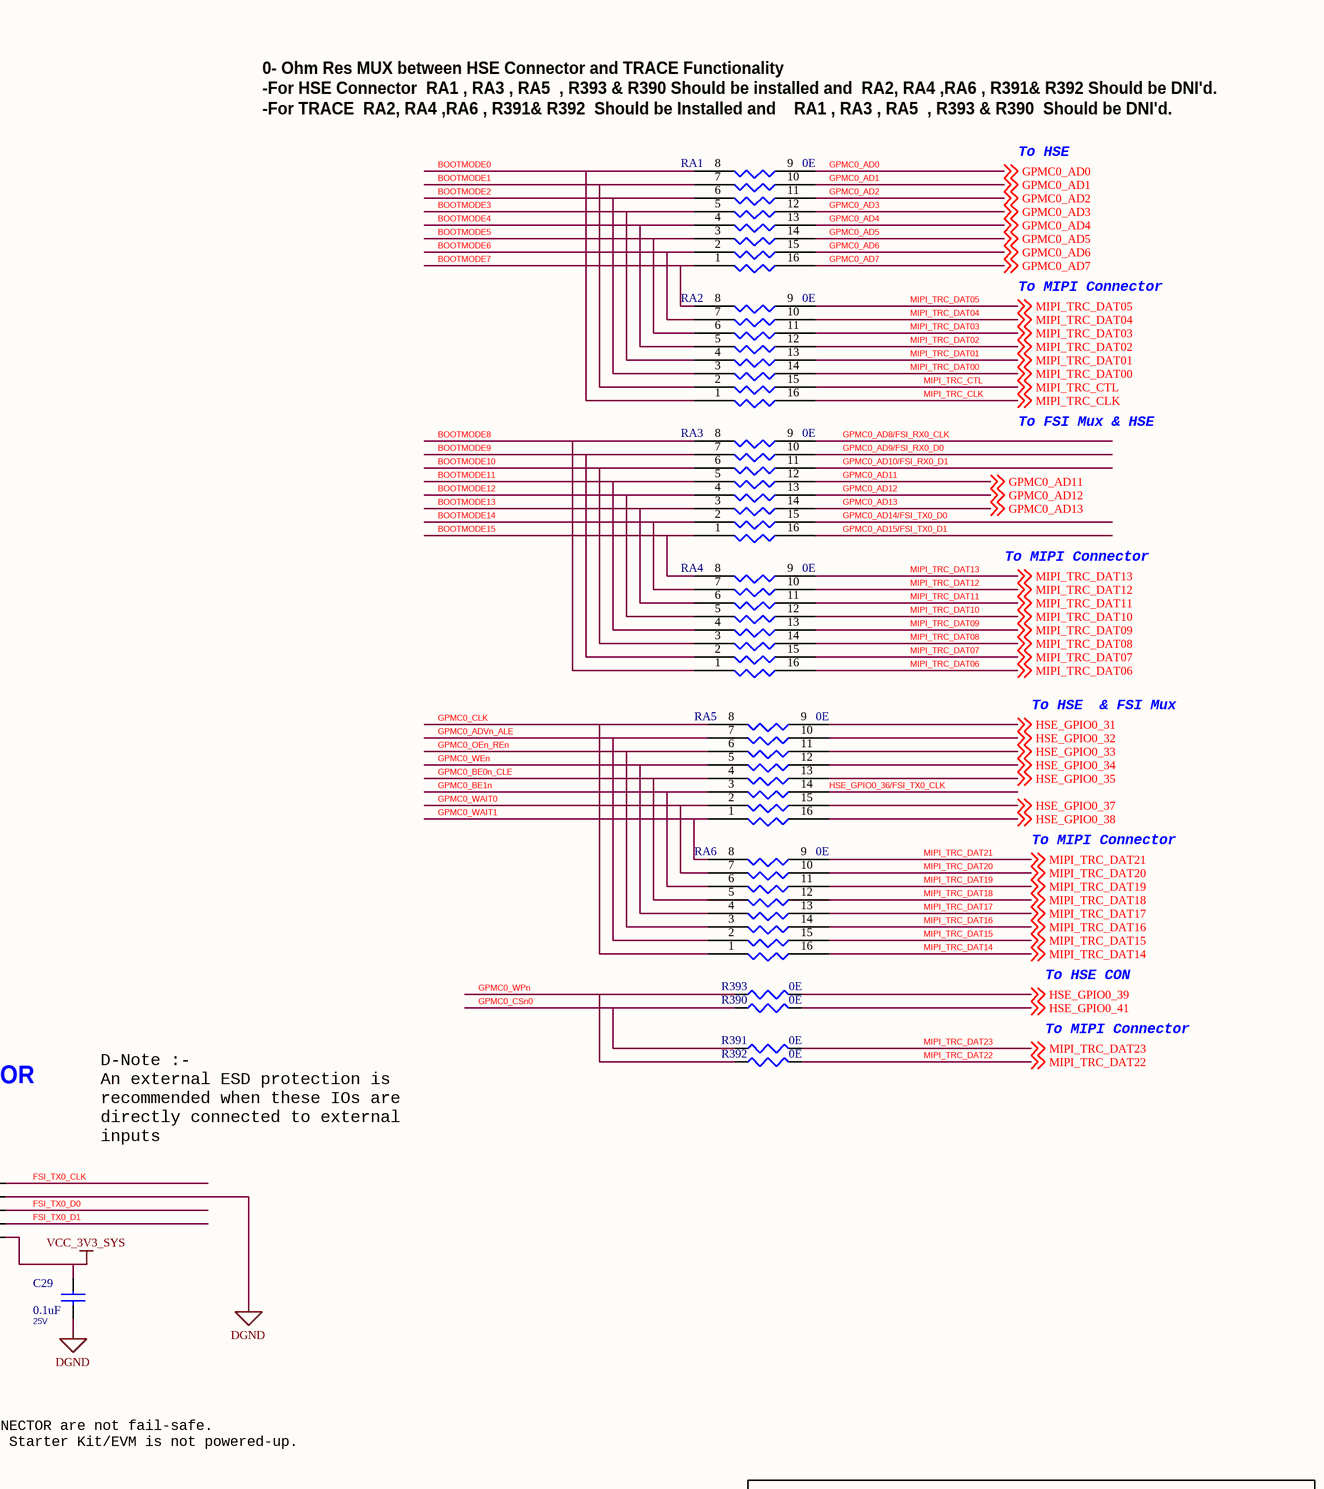
[diagram p49: 28.SchDoc, top right]
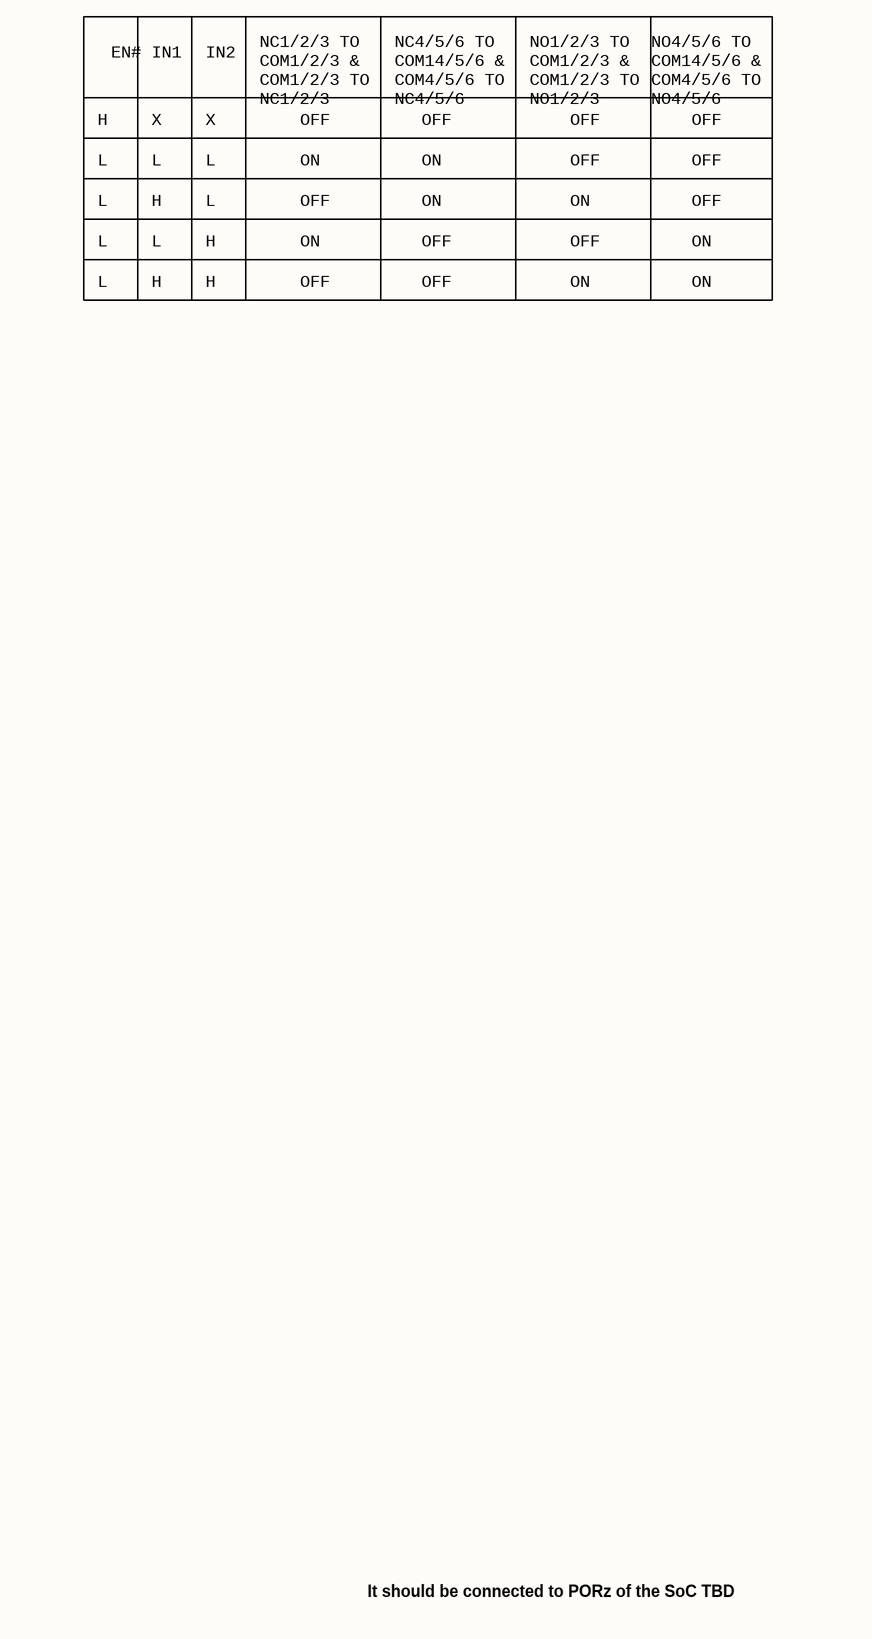
[diagram p50: 28.SchDoc, bottom left]
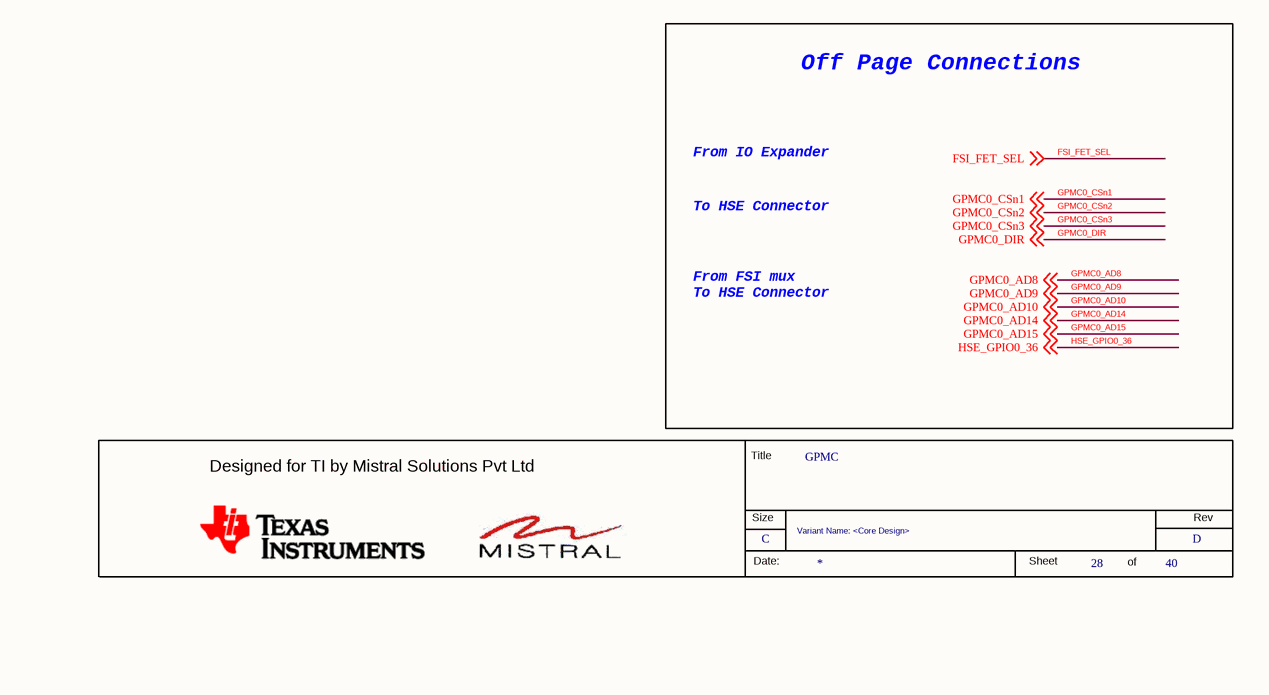
[diagram p51: 28.SchDoc, bottom right]

### Parts
(Parts that share a designator on the sheet are numbered #1, #2 ... from top to bottom, then left to right.)
*#28  RevCode: D  Title: GPMC  Page Size: C  Page Number: 28  Page Count: 40  Variant Name: <Core Design>  (hidden comment: MISTRAL_TITLEBLK_CSIZE)  (graphical)
C26  0.1uF  Voltage: 25V  [CAP0402_0-75]
C29  0.1uF  Voltage: 25V  [CAP0402_0-75]
J7  HDR_2X5  [HDR_5X2_100_S_T_8-6]
R21  10K  [RES0402_0-5]
R218  10K  [RES0402_0-5]
R390  0E  [RES0402_0-5]
R391  0E  [RES0402_0-5]
R392  0E  [RES0402_0-5]
R393  0E  [RES0402_0-5]
RA1  0E  [RESA_EXB2HV_0602-8_0-6]
RA2  0E  [RESA_EXB2HV_0602-8_0-6]
RA3  0E  [RESA_EXB2HV_0602-8_0-6]
RA4  0E  [RESA_EXB2HV_0602-8_0-6]
RA5  0E  [RESA_EXB2HV_0602-8_0-6]
RA6  0E  [RESA_EXB2HV_0602-8_0-6]
U8  TS3A27518ERTWR  [QFN24_19-68_160X160_0-8]
U23  AM6442BSFGHAALV  [FCBGA441_31-49_680X680_2-6]  (part F of 16)

### Nets
DGND: C26.2 C29.2 J7.3 J7.4 R21.2 R218.2 U8.2(GND) U8.25(PAD)
VCC_3V3_SYS: C26.1 C29.1 J7.10 U8.5(V+)
BOOTMODE0: RA1.8 RA2.1 U23.T20(GPMC0_AD0) ; off-sheet BOOTMODE0
BOOTMODE1: RA1.7 RA2.2 U23.U21(GPMC0_AD1) ; off-sheet BOOTMODE1
BOOTMODE2: RA1.6 RA2.3 U23.T18(GPMC0_AD2) ; off-sheet BOOTMODE2
BOOTMODE3: RA1.5 RA2.4 U23.U20(GPMC0_AD3) ; off-sheet BOOTMODE3
BOOTMODE4: RA1.4 RA2.5 U23.U18(GPMC0_AD4) ; off-sheet BOOTMODE4
BOOTMODE5: RA1.3 RA2.6 U23.U19(GPMC0_AD5) ; off-sheet BOOTMODE5
BOOTMODE6: RA1.2 RA2.7 U23.V20(GPMC0_AD6) ; off-sheet BOOTMODE6
BOOTMODE7: RA1.1 RA2.8 U23.V21(GPMC0_AD7) ; off-sheet BOOTMODE7
BOOTMODE8: RA3.8 RA4.1 U23.V19(GPMC0_AD8) ; off-sheet BOOTMODE8
BOOTMODE9: RA3.7 RA4.2 U23.T17(GPMC0_AD9) ; off-sheet BOOTMODE9
BOOTMODE10: RA3.6 RA4.3 U23.R16(GPMC0_AD10) ; off-sheet BOOTMODE10
BOOTMODE11: RA3.5 RA4.4 U23.W20(GPMC0_AD11) ; off-sheet BOOTMODE11
BOOTMODE12: RA3.4 RA4.5 U23.W21(GPMC0_AD12) ; off-sheet BOOTMODE12
BOOTMODE13: RA3.3 RA4.6 U23.V18(GPMC0_AD13) ; off-sheet BOOTMODE13
BOOTMODE14: RA3.2 RA4.7 U23.Y21(GPMC0_AD14) ; off-sheet BOOTMODE14
BOOTMODE15: RA3.1 RA4.8 U23.Y20(GPMC0_AD15) ; off-sheet BOOTMODE15
FSI_FET_ENn: R21.1 U8.17(~{EN})
FSI_FET_SEL: R218.1 U8.11(IN2) U8.21(IN1) ; off-sheet FSI_FET_SEL
FSI_RX0_CLK: J7.1 U8.8(NO1)
FSI_RX0_D0: J7.5 U8.10(NO2)
FSI_RX0_D1: J7.7 U8.12(NO3)
FSI_TX0_CLK: J7.2 U8.13(NO6)
FSI_TX0_D0: J7.6 U8.14(NO4)
FSI_TX0_D1: J7.8 U8.15(NO5)
GPMC0_AD0: RA1.9 ; off-sheet GPMC0_AD0
GPMC0_AD1: RA1.10 ; off-sheet GPMC0_AD1
GPMC0_AD2: RA1.11 ; off-sheet GPMC0_AD2
GPMC0_AD3: RA1.12 ; off-sheet GPMC0_AD3
GPMC0_AD4: RA1.13 ; off-sheet GPMC0_AD4
GPMC0_AD5: RA1.14 ; off-sheet GPMC0_AD5
GPMC0_AD6: RA1.15 ; off-sheet GPMC0_AD6
GPMC0_AD7: RA1.16 ; off-sheet GPMC0_AD7
GPMC0_AD8: U8.23(NC1) ; off-sheet GPMC0_AD8
GPMC0_AD8/FSI_RX0_CLK: RA3.9 U8.1(COM1)
GPMC0_AD9: U8.22(NC2) ; off-sheet GPMC0_AD9
GPMC0_AD9/FSI_RX0_D0: RA3.10 U8.3(COM2)
GPMC0_AD10: U8.20(NC3) ; off-sheet GPMC0_AD10
GPMC0_AD10/FSI_RX0_D1: RA3.11 U8.4(COM3)
GPMC0_AD11: RA3.12 ; off-sheet GPMC0_AD11
GPMC0_AD12: RA3.13 ; off-sheet GPMC0_AD12
GPMC0_AD13: RA3.14 ; off-sheet GPMC0_AD13
GPMC0_AD14: U8.18(NC4) ; off-sheet GPMC0_AD14
GPMC0_AD14/FSI_TX0_D0: RA3.15 U8.6(COM4)
GPMC0_AD15: U8.16(NC5) ; off-sheet GPMC0_AD15
GPMC0_AD15/FSI_TX0_D1: RA3.16 U8.7(COM5)
GPMC0_ADVn_ALE: RA5.7 RA6.2 U23.P16(GPMC0_ADVN_ALE)
GPMC0_BE0n_CLE: RA5.4 RA6.5 U23.P17(GPMC0_BE0N_CLE)
GPMC0_BE1n: RA5.3 RA6.6 U23.T19(GPMC0_BE1N)
GPMC0_CLK: RA5.8 RA6.1 U23.R17(GPMC0_CLK)
GPMC0_CSn0: R390.1 R391.1 U23.R19(GPMC0_CSN0)
GPMC0_CSn1: U23.R20(GPMC0_CSN1) ; off-sheet GPMC0_CSn1
GPMC0_CSn2: U23.P19(GPMC0_CSN2) ; off-sheet GPMC0_CSn2
GPMC0_CSn3: U23.R21(GPMC0_CSN3) ; off-sheet GPMC0_CSn3
GPMC0_DIR: U23.N17(GPMC0_DIR) ; off-sheet GPMC0_DIR
GPMC0_OEn_REn: RA5.6 RA6.3 U23.R18(GPMC0_OEN_REN)
GPMC0_WAIT0: RA5.2 RA6.7 U23.W19(GPMC0_WAIT0)
GPMC0_WAIT1: RA5.1 RA6.8 U23.Y18(GPMC0_WAIT1)
GPMC0_WEn: RA5.5 RA6.4 U23.T21(GPMC0_WEN)
GPMC0_WPn: R392.1 R393.1 U23.N16(GPMC0_WPN)
HSE_GPIO0_31: RA5.9 ; off-sheet HSE_GPIO0_31
HSE_GPIO0_32: RA5.10 ; off-sheet HSE_GPIO0_32
HSE_GPIO0_33: RA5.11 ; off-sheet HSE_GPIO0_33
HSE_GPIO0_34: RA5.12 ; off-sheet HSE_GPIO0_34
HSE_GPIO0_35: RA5.13 ; off-sheet HSE_GPIO0_35
HSE_GPIO0_36: U8.19(NC6) ; off-sheet HSE_GPIO0_36
HSE_GPIO0_36/FSI_TX0_CLK: RA5.14 U8.9(COM6)
HSE_GPIO0_37: RA5.15 ; off-sheet HSE_GPIO0_37
HSE_GPIO0_38: RA5.16 ; off-sheet HSE_GPIO0_38
HSE_GPIO0_39: R393.2 ; off-sheet HSE_GPIO0_39
HSE_GPIO0_41: R390.2 ; off-sheet HSE_GPIO0_41
MIPI_TRC_CLK: RA2.16 ; off-sheet MIPI_TRC_CLK
MIPI_TRC_CTL: RA2.15 ; off-sheet MIPI_TRC_CTL
MIPI_TRC_DAT00: RA2.14 ; off-sheet MIPI_TRC_DAT00
MIPI_TRC_DAT01: RA2.13 ; off-sheet MIPI_TRC_DAT01
MIPI_TRC_DAT02: RA2.12 ; off-sheet MIPI_TRC_DAT02
MIPI_TRC_DAT03: RA2.11 ; off-sheet MIPI_TRC_DAT03
MIPI_TRC_DAT04: RA2.10 ; off-sheet MIPI_TRC_DAT04
MIPI_TRC_DAT05: RA2.9 ; off-sheet MIPI_TRC_DAT05
MIPI_TRC_DAT06: RA4.16 ; off-sheet MIPI_TRC_DAT06
MIPI_TRC_DAT07: RA4.15 ; off-sheet MIPI_TRC_DAT07
MIPI_TRC_DAT08: RA4.14 ; off-sheet MIPI_TRC_DAT08
MIPI_TRC_DAT09: RA4.13 ; off-sheet MIPI_TRC_DAT09
MIPI_TRC_DAT10: RA4.12 ; off-sheet MIPI_TRC_DAT10
MIPI_TRC_DAT11: RA4.11 ; off-sheet MIPI_TRC_DAT11
MIPI_TRC_DAT12: RA4.10 ; off-sheet MIPI_TRC_DAT12
MIPI_TRC_DAT13: RA4.9 ; off-sheet MIPI_TRC_DAT13
MIPI_TRC_DAT14: RA6.16 ; off-sheet MIPI_TRC_DAT14
MIPI_TRC_DAT15: RA6.15 ; off-sheet MIPI_TRC_DAT15
MIPI_TRC_DAT16: RA6.14 ; off-sheet MIPI_TRC_DAT16
MIPI_TRC_DAT17: RA6.13 ; off-sheet MIPI_TRC_DAT17
MIPI_TRC_DAT18: RA6.12 ; off-sheet MIPI_TRC_DAT18
MIPI_TRC_DAT19: RA6.11 ; off-sheet MIPI_TRC_DAT19
MIPI_TRC_DAT20: RA6.10 ; off-sheet MIPI_TRC_DAT20
MIPI_TRC_DAT21: RA6.9 ; off-sheet MIPI_TRC_DAT21
MIPI_TRC_DAT22: R392.2 ; off-sheet MIPI_TRC_DAT22
MIPI_TRC_DAT23: R391.2 ; off-sheet MIPI_TRC_DAT23

Not connected (* = marked no-connect by the designer): J7 9*; U8 24(N.C.)*

### Notes on the sheet
- 0- Ohm Res MUX between HSE Connector and TRACE Functionality
  -For HSE Connector  RA1 , RA3 , RA5  , R393 & R390 Should be installed and  RA2, RA4 ,RA6 , R391& R392 Should be DNI'd.
  -For TRACE  RA2, RA4 ,RA6 , R391& R392  Should be Installed and    RA1 , RA3 , RA5  , R393 & R390  Should be DNI'd.
- (near U23) D-Note :-
  Add a series resistor 0R
  when used as GPMC0_CLK
- GPMC
- To HSE
- D-Note :-
  SOC IO buffers for signals used for GPMC
  interface are disabled during reset
  The required pulls for the interfaced
  signals are provided on the GPMC interface
  card
- To Boot Mode Buffer ,
  HSE & MIPI Conn
- To MIPI Connector
- D-Note :-
  Shorting of bootmode inputs (IOs) is
  not recommended or allowed since the
  IOs have alternate functions that could
  be configured after boot
  Shorting the bootmode pins directly to
  VCC or ground directly is not
  recommended
  Connect each of the bootmode pins
  through separate resistor
  Choose the bootmode resistor value
  based on the use case (10K or similar)
- To FSI Mux & HSE
- To HSE  & FSI Mux
- GPMC TO FSI & HSE CONNECTOR
- To HSE CON
- D-Note :-
  An external ESD protection is
  recommended when these IOs are
  directly connected to external
  inputs
- FSI CONNECTOR
- (near U8) FSI_FET_SEL
  fromIO
  Expander
- D-Note :-
  Processor IOs connected to TEST FSI CONNECTOR are not fail-safe.
  No external input shall be applied when Starter Kit/EVM is not powered-up.
- Off Page Connections
- TS3A27518ERTWR Truth Table
- EN#
- IN1
- IN2
- NC1/2/3 TO
  COM1/2/3 &
  COM1/2/3 TO
  NC1/2/3
- NC4/5/6 TO
  COM14/5/6 &
  COM4/5/6 TO
  NC4/5/6
- NO1/2/3 TO
  COM1/2/3 &
  COM1/2/3 TO
  NO1/2/3
- NO4/5/6 TO
  COM14/5/6 &
  COM4/5/6 TO
  NO4/5/6
- To HSE Connector
- From IO Expander
- H
- X
- OFF
- From FSI mux
  To HSE Connector
- L
- ON
- It should be connected to PORz of the SoC TBD
- (in symbol MISTRAL_TITLEBLK_CSIZE) Title; Designed for TI by Mistral Solutions Pvt Ltd; Size; Rev; Date:; Sheet; of

### Library data of the parts
*#28 = MISTRAL_TITLEBLK_CSIZE: Issue: 1.0; Page Create Date: March  8, 1995; Page Modify Date: *
C26 C29 = CAP_Dup3: as C12-C14 on sheet 27; PCB Footprint: CAP0402_0-75; Footprint Path: Y:\MIS_DATABASE\Library\ALTIUM_TOOL\PCB_FOOTPRINTS\Altium_Footprint_Lib.PcbLib; Library Path: Y:\MIS_DATABASE\Library\ALTIUM_TOOL\SCHEMATICS_PARTS\MS_DISCRETE_Library.schlib; Footprint Ref: CAP0402_0-75; Library Ref: CAP; MECHANICAL 3D STEP FILE: CAP0402_0-75; Chkd/date: MANIRAJA/170820; Crtd /date: ALVY/170820; Datasheet: Y:\MIS_DATABASE\DATASHEETS\CAPACITORS\885012105018.PDF; Temperature: -55癈+85癈; Weight: 0.65mg; Height: 0.55MM; Distributor_part_number: 732-7495-1-ND; Distributor_name: DIGIKEY; Package: 0402; Tolerance: 20%
J7 = HEADER_5X2: CON HDR 2X5 2.54MM PITCH ST TH; Part_type: CONNECTOR\HEADERS; Mfr_part_number: 67997-410HLF; Mfr_name: FCI; Mistral Part No: 150015100040-R; Custom_Duty: 24%; Customs_HS_Code: 85369090; Wattage: NA; Project: CYPHY_ROADKILL; PCB Footprint: HDR_5X2_100_S_T_8-6; MECHANICAL 3D STEP FILE: HDR_5X2_100_S_T_8-6; Chkd/date: VASANTHA/220317; Crtd /date: MANIRAJA/210317; Datasheet: Y:\MIS_DATABASE\DATASHEETS\CONNECTORS\67997.PDF; Temperature: NA; Weight: NA; Height: 8.58MM; Library Ref: HEADER_5X2; Distributor_part_number: 609-3243-ND; Distributor_name: DIGIKEY; Package: THRU-HOLE; Voltage: NA; Tolerance: NA
R21 R218 = RESISTOR_Dup6: RES 10K 1/16W 5% 0402; Part_type: RESISTORS\FIXED; Mfr_part_number: RC0402JR-0710KL; Mfr_name: YAGEO AMERICA; Mistral Part No: 110011060021-R; Custom_Duty: 15%; Customs_HS_Code: 85332119; Voltage: NA; Project: HSE; PCB Footprint: RES0402_0-5; Footprint Path: Y:\MIS_DATABASE\Library\ALTIUM_TOOL\PCB_FOOTPRINTS\Altium_Footprint_Lib.PcbLib; Library Path: Y:\MIS_DATABASE\Library\ALTIUM_TOOL\SCHEMATICS_PARTS\MS_DISCRETE_Library.schlib; Footprint Ref: RES0402_0-5; Library Ref: RESISTOR; MECHANICAL 3D STEP FILE: RES0402_0-5; Chkd/date: VASANTHA/061216; Crtd /date: MAZHAR/230805; Datasheet: Y:\MIS_DATABASE\DATASHEETS\RESISTORS\RCXXXXL-SER_MAR18.PDF; Temperature: -55癈+155癈; Weight: 0.65mg; Height: 0.40MM; Distributor_part_number: 311-10KJRCT-ND; Distributor_name: DIGIKEY; Package: 0402; Wattage: 1/16W; Tolerance: 5%
R390-R392 = RESISTOR_Dup5: RES 0E 1/16W JUMPER 0402; Part_type: RESISTORS\FIXED; Mfr_part_number: CRCW04020000Z0ED; Mfr_name: VISHAY; Mistral Part No: 110010080019-R; Custom_Duty: 15%; Customs_HS_Code: 85332119; Voltage: NA; Project: PB_BUGBASE; PCB Footprint: RES0402_0-5; Chkd/date: VASANTHA/201216; Crtd /date: MUDDU/190810; Datasheet: Y:\MIS_DATABASE\DATASHEETS\RESISTORS\CRCW0603.PDF; Temperature: -55癈+155癈; Weight: 0.65mg; Height: 0.40MM; Distributor_part_number: 541-0.0JCT-ND; Distributor_name: DIGIKEY; Package: 0402; Wattage: 1/16W; Tolerance: NA; MECHANICAL 3D STEP FILE: RES0402_0-5; SIGNAL_MODEL: RES; Library Ref: RESISTOR; Footprint Ref: RES0402_0-5; Library Path: Y:\MIS_DATABASE\Library\ALTIUM_TOOL\SCHEMATICS_PARTS\MS_DISCRETE_Library.schlib; Footprint Path: Y:\MIS_DATABASE\Library\ALTIUM_TOOL\PCB_FOOTPRINTS\Altium_Footprint_Lib.PcbLib
R393 = RESISTOR_Dup5: RES 0E 1/16W JUMPER 0402; Mistral Part No: 110010080019-R; Mfr_name: VISHAY; Mfr_part_number: CRCW04020000Z0ED; Part_type: RESISTORS\FIXED; Project: PB_BUGBASE; Tolerance: NA; Customs_HS_Code: 85332119; Custom_Duty: 15%; PCB Footprint: RES0402_0-5; Voltage: NA; Wattage: 1/16W; Package: 0402; Distributor_name: DIGIKEY; Distributor_part_number: 541-0.0JCT-ND; Height: 0.40MM; Weight: 0.65mg; Temperature: -55癈+155癈; Datasheet: Y:\MIS_DATABASE\DATASHEETS\RESISTORS\CRCW0603.PDF; Crtd /date: MUDDU/190810; Chkd/date: VASANTHA/201216; MECHANICAL 3D STEP FILE: RES0402_0-5; SIGNAL_MODEL: RES; Library Ref: RESISTOR; Footprint Ref: RES0402_0-5; Library Path: Y:\MIS_DATABASE\Library\ALTIUM_TOOL\SCHEMATICS_PARTS\MS_DISCRETE_Library.schlib; Footprint Path: Y:\MIS_DATABASE\Library\ALTIUM_TOOL\PCB_FOOTPRINTS\Altium_Footprint_Lib.PcbLib
RA1 RA4 RA5 = RESARR_ISO8_0402: RES ARRAY 0E 1/16W JUMPER 0602-8; Part_type: RESISTORS\ARRAY; Mfr_part_number: EXB-2HVR000V; Mfr_name: PANASONIC-ECG; Mistral Part No: 110009030004-R; Custom_Duty: 15%; Customs_HS_Code: 85332119; Voltage: NA; Project: V12SFP; SIGNAL_MODEL: RESA; PCB Footprint: RESA_EXB2HV_0602-8_0-6; Footprint Path: Y:\MIS_DATABASE\Library\ALTIUM_TOOL\PCB_FOOTPRINTS\Altium_Footprint_Lib.PcbLib; Library Path: Y:\MIS_DATABASE\Library\ALTIUM_TOOL\SCHEMATICS_PARTS\MS_DISCRETE_Library.schlib; MECHANICAL 3D STEP FILE: RESA_EXB2HV_0602-8_0-6; Temperature: -55癈+125癈; Weight: 9mg; Wattage: 1/16W; Tolerance: NA; Footprint Ref: RESA_EXB2HV_0602-8_0-6; Chkd/date: SHREESHAIL/121205; Crtd /date: MAZHAR/300505; Datasheet: Y:\MIS_DATABASE\DATASHEETS\RESISTORS\EXB-18V.PDF; Height: 0.55MM; Distributor_part_number: Y1000CT-ND; Distributor_name: DIGIKEY; Package: 0602-8; Library Ref: RESARR_ISO8_0402
RA2 RA3 = RESARR_ISO8_0402: RES ARRAY 0E 1/16W JUMPER 0602-8; Mistral Part No: 110009030004-R; Mfr_name: PANASONIC-ECG; Mfr_part_number: EXB-2HVR000V; Part_type: RESISTORS\ARRAY; Custom_Duty: 15%; Customs_HS_Code: 85332119; Voltage: NA; SIGNAL_MODEL: RESA; Project: V12SFP; PCB Footprint: RESA_EXB2HV_0602-8_0-6; Footprint Path: Y:\MIS_DATABASE\Library\ALTIUM_TOOL\PCB_FOOTPRINTS\Altium_Footprint_Lib.PcbLib; Library Path: Y:\MIS_DATABASE\Library\ALTIUM_TOOL\SCHEMATICS_PARTS\MS_DISCRETE_Library.schlib; MECHANICAL 3D STEP FILE: RESA_EXB2HV_0602-8_0-6; Temperature: -55癈+125癈; Weight: 9mg; Wattage: 1/16W; Tolerance: NA; Footprint Ref: RESA_EXB2HV_0602-8_0-6; Library Ref: RESARR_ISO8_0402; Package: 0602-8; Distributor_name: DIGIKEY; Distributor_part_number: Y1000CT-ND; Height: 0.55MM; Datasheet: Y:\MIS_DATABASE\DATASHEETS\RESISTORS\EXB-18V.PDF; Crtd /date: MAZHAR/300505; Chkd/date: SHREESHAIL/121205
RA6 = RESARR_ISO8_0402: RES ARRAY 0E 1/16W JUMPER 0602-8; Mistral Part No: 110009030004-R; Mfr_name: PANASONIC-ECG; Mfr_part_number: EXB-2HVR000V; Part_type: RESISTORS\ARRAY; SIGNAL_MODEL: RESA; Project: V12SFP; Tolerance: NA; Customs_HS_Code: 85332119; Custom_Duty: 15%; PCB Footprint: RESA_EXB2HV_0602-8_0-6; Library Ref: RESARR_ISO8_0402; Package: 0602-8; Distributor_name: DIGIKEY; Distributor_part_number: Y1000CT-ND; Height: 0.55MM; Datasheet: Y:\MIS_DATABASE\DATASHEETS\RESISTORS\EXB-18V.PDF; Crtd /date: MAZHAR/300505; Chkd/date: SHREESHAIL/121205; Footprint Ref: RESA_EXB2HV_0602-8_0-6; Voltage: NA; Wattage: 1/16W; Weight: 9mg; Temperature: -55癈+125癈; MECHANICAL 3D STEP FILE: RESA_EXB2HV_0602-8_0-6; Library Path: Y:\MIS_DATABASE\Library\ALTIUM_TOOL\SCHEMATICS_PARTS\MS_DISCRETE_Library.schlib; Footprint Path: Y:\MIS_DATABASE\Library\ALTIUM_TOOL\PCB_FOOTPRINTS\Altium_Footprint_Lib.PcbLib
U8 = TS3A27518ERTWR_QFN24: IC 6-BIT 1OF2 MULTIPLEXER/DEMULTIPLEXER WITH ESD & LCCI QFN24; Part_type: ICS\DIGITAL\COMBINATIONAL; Mfr_name: TEXAS INSTRUMENTS; Mistral Part No: 141009070012-R; Custom_Duty: 15%; Customs_HS_Code: 85423100; Wattage: NA; Project: BUG_BASE-II; PCB Footprint: QFN24_19-68_160X160_0-8; MECHANICAL 3D STEP FILE: QFN24_19-68_160X160_0-8; Chkd/date: MANIRAJA/111017; Crtd /date: USMAN/230709; Datasheet: Y:\MIS_DATABASE\DATASHEETS\ICS\DIGITAL\BUSTRANSCEIVER\TS3A27518E.PDF; Temperature: -40癈+85癈; Weight: NA; Height: 0.80MM; Library Ref: TS3A27518ERTWR_QFN24; Distributor_part_number: 296-25415-1-ND; Distributor_name: DIGIKEY; Package: QFN24; Voltage: NA; Tolerance: NA; Mfr_part_number: TS3A27518ERTWR
U23 = XAM6442BSFGGAALV_BGA441: IC AM64x SoC MICROPROCESSOR BGA441; Part_type: ICS\DIGITAL\MICROPROCESSOR; Mfr_name: TEXAS INSTRUMENTS; Mistral Part No: 141220080002; Custom_Duty: 15%; Customs_HS_Code: 85423100; Wattage: NA; Project: AM64x-GP_EVM BRD; Footprint Path: Y:\MIS_DATABASE\Library\ALTIUM_TOOL\PCB_FOOTPRINTS\Altium_Footprint_Lib.PcbLib; Library Path: Y:\MIS_DATABASE\Library\ALTIUM_TOOL\SCHEMATICS_PARTS\MS_MICROPROCESSOR_Library.schlib; MECHANICAL 3D STEP FILE: FCBGA441_31-49_680X680_2-6; RoHS: NA; Chkd/date: ALVY/300322; Crtd /date: ALVY/300322; Datasheet: Y:\MIS_DATABASE\DATASHEETS\ICS\DIGITAL\MICROCONTROLLER\AM64-SoC_SVB.PDF; Temperature: NA; Weight: NA; Height: 2.57MM; Library Ref: XAM6442BSFGGAALV_BGA441; Distributor_part_number: NA; Distributor_name: NA; Package: BGA441; Voltage: NA; Tolerance: NA; Mfr_part_number: AM6442BSFGHAALV; Footprint Ref: FCBGA441_31-49_680X680_2-6; PCB Footprint: FCBGA441_31-49_680X680_2-6